# Altium schematic sheet 02_MCU.SchDoc: MCU
size A4; SheetNumber: 1; SheetTotal: 3; PageSetup: Record=PageOptions|CenterHorizontal=True|CenterVertical=True|PrintScale=1.09|XCorrection=1.00|YCorrection=1.00|PrintKind=0|BorderSize=5000000|LeftOffset=0|BottomOffset=0|Orientation=2|PaperLength=1000|PaperWidth=1000|Scale=100|PaperSource=7|PrintQuality=-3|MediaType=1|DitherType=10|PrintScaleMode=1|PaperKind=A4|PaperIndex=9; SK_ProjectName: Analog Resource Monitor; Version: R01
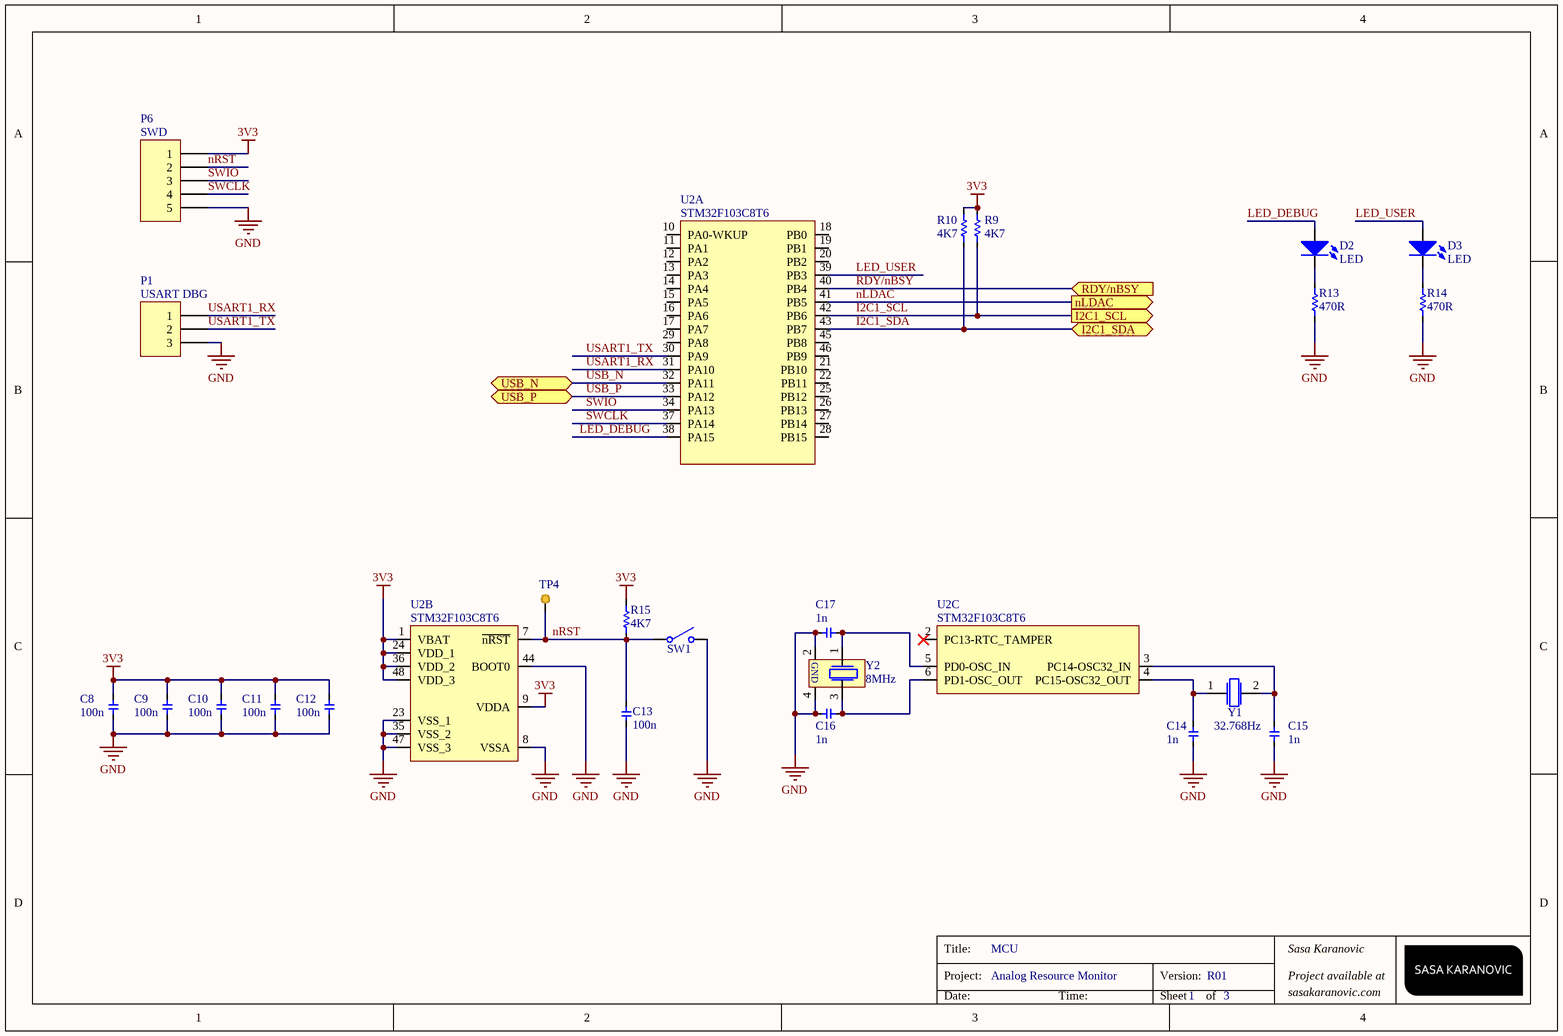
[diagram p0: 02_MCU.SchDoc]

## Parts
C8  value 100n  [0603 - CAP]  (hidden comment: Cap)
C9  value 100n  [0603 - CAP]  (hidden comment: Cap)
C10  value 100n  [0603 - CAP]  (hidden comment: Cap)
C11  value 100n  [0603 - CAP]  (hidden comment: Cap)
C12  value 100n  [0603 - CAP]  (hidden comment: Cap)
C13  value 100n  [0603 - CAP]  (hidden comment: Cap)
C14  value 1n  [0603 - CAP]  (hidden comment: Cap)
C15  value 1n  [0603 - CAP]  (hidden comment: Cap)
C16  value 1n  [0603 - CAP]  (hidden comment: Cap)
C17  value 1n  [0603 - CAP]  (hidden comment: Cap)
D2  LED  [0603 Diode]
D3  LED  [0603 Diode]
P1  USART DBG  [Header 3x1 SMD]
P6  SWD  [Header 5x1 SMD]
R9  value 4K7  [0603]  (hidden comment: Res)
R10  value 4K7  [0603]  (hidden comment: Res)
R13  value 470R  [0603]  (hidden comment: Res)
R14  value 470R  [0603]  (hidden comment: Res)
R15  value 4K7  [0603]  (hidden comment: Res)
SW1  Switch  [EVQ-5PN04K]  (value not drawn)
TP4  Test Point 0.6mm  [TP_SMD_1mm]  (value not drawn)  (no BOM)
U2  STM32F103C8T6  [LQFP48_7x7mm]  (parts A,B,C of 3)
Y1  32.768Hz  [ABS07-120]
Y2  8MHz  [ABM8G]

## Ports
I2C1_SCL (out), I2C1_SDA (bidir), nLDAC (out), RDY/nBSY (in), USB_N (bidir), USB_P (bidir)

## Nets
3V3: C8.2 C9.2 C10.2 C11.2 C12.2 P6.1 R9.1 R10.1 R15.1 U2.1(VBAT) U2.9(VDDA) U2.24(VDD_1) U2.36(VDD_2) U2.48(VDD_3)
GND: C8.1 C9.1 C10.1 C11.1 C12.1 C13.1 C14.1 C15.1 C16.2 C17.2 P1.3 P6.5 R13.2 R14.2 SW1.2(COMMON2) U2.8(VSSA) U2.23(VSS_1) U2.35(VSS_2) U2.44(BOOT0) U2.47(VSS_3) Y2.2(OSC2) Y2.4(OSC4)
I2C1_SCL: R9.2 U2.42(PB6) ; port I2C1_SCL
I2C1_SDA: R10.2 U2.43(PB7) ; port I2C1_SDA
LED_DEBUG: D2.A U2.38(PA15)
LED_USER: D3.A U2.39(PB3)
nLDAC: U2.41(PB5) ; port nLDAC
nRST: C13.2 P6.2 R15.2 SW1.1(COMMON1) TP4.1 U2.7(~{nRST})
RDY/nBSY: U2.40(PB4) ; port RDY/nBSY
SWCLK: P6.4 U2.37(PA14)
SWIO: P6.3 U2.34(PA13)
USART1_RX: P1.1 U2.31(PA10)
USART1_TX: P1.2 U2.30(PA9)
USB_N: U2.32(PA11) ; port USB_N
USB_P: U2.33(PA12) ; port USB_P
NetC14_2: C14.2 U2.4(PC15-OSC32_OUT) Y1.1(OSC1)
NetC15_2: C15.2 U2.3(PC14-OSC32_IN) Y1.2(OSC2)
NetC16_1: C16.1 U2.6(PD1-OSC_OUT) Y2.3(OSC3)
NetC17_1: C17.1 U2.5(PD0-OSC_IN) Y2.1(OSC1)
NetD2_K: D2.K R13.1
NetD3_K: D3.K R14.1

Not connected (* = marked no-connect by the designer): U2 2(PC13-RTC_TAMPER)* 10(PA0-WKUP) 11(PA1) 12(PA2) 13(PA3) 14(PA4) 15(PA5) 16(PA6) 17(PA7) 18(PB0) 19(PB1) 20(PB2) 21(PB10) 22(PB11) 25(PB12) 26(PB13) 27(PB14) 28(PB15) 29(PA8) 45(PB8) 46(PB9)

## Notes on the sheet
- Title:
- Project:
- Version:
- sasakaranovic.com
- Sasa Karanovic
- Project available at
- Date:
- Time:
- Sheet
- of
- (in symbol ABM8G) GND

## Library data of the parts
C8-C13 = Cap: Capacitor; Manufacturer: AVX Corporation; Manufacturer Part Number: 06035C104KAT2A; Distributor Part Number: 478-5052-1-ND; Distributor: DigiKey
C14-C17 = Cap: Capacitor; Distributor: DigiKey
D2 D3 = LED: Typical RED GaAs LED
P1 = Header 3: Header, 3-Pin
P6 = Header 5: Header, 5-Pin
R9 R10 R15 = Res: Resistor; Manufacturer: Yageo; Manufacturer Part Number: RC0603JR-070RL; Distributor: DigiKey; Distributor Part Number: 311-0.0GRCT-ND
R13 R14 = Res: Resistor; Manufacturer: Yageo; Manufacturer Part Number: RC0603FR-07470RL; Distributor: DigiKey; Distributor Part Number: 311-470HRCT-ND
SW1 = EVQ-5PN04K: SWITCH TACTILE SPST-NO 0.05A 12V; Manufacturer: Panasonic Electronic Components; Distributor: DigiKey; Distributor Part Number: P13595SCT-ND; Manufacturer Part Number: EVQ-5PN04K
TP4 = TP
U2 = STM32F103C8T6: IC MCU 32BIT 64KB FLASH 48LQFP; Manufacturer: STMicroelectronics; Distributor: DigiKey; Distributor Part Number: 497-6063-ND; Manufacturer Part Number: STM32F103C8T6
Y1 = ABS07-120-32.768KHZ-T: CRYSTAL 32.7680KHZ 6PF SMD; Manufacturer: Abracon LLC; Distributor: DigiKey; Distributor Part Number: 535-11937-1-ND; Manufacturer Part Number: ABS07-120-32.768KHZ-T
Y2 = ABM8G: CRYSTAL 16.0000MHZ 10PF SMD; Manufacturer: Abracon LLC; Manufacturer Part Number: ABM8G-16.000MHZ-4Y-T3; Distributor: DigiKey; Distributor Part Number: 535-10907-1-ND